# Altium project 16_Channel.PrjPCB
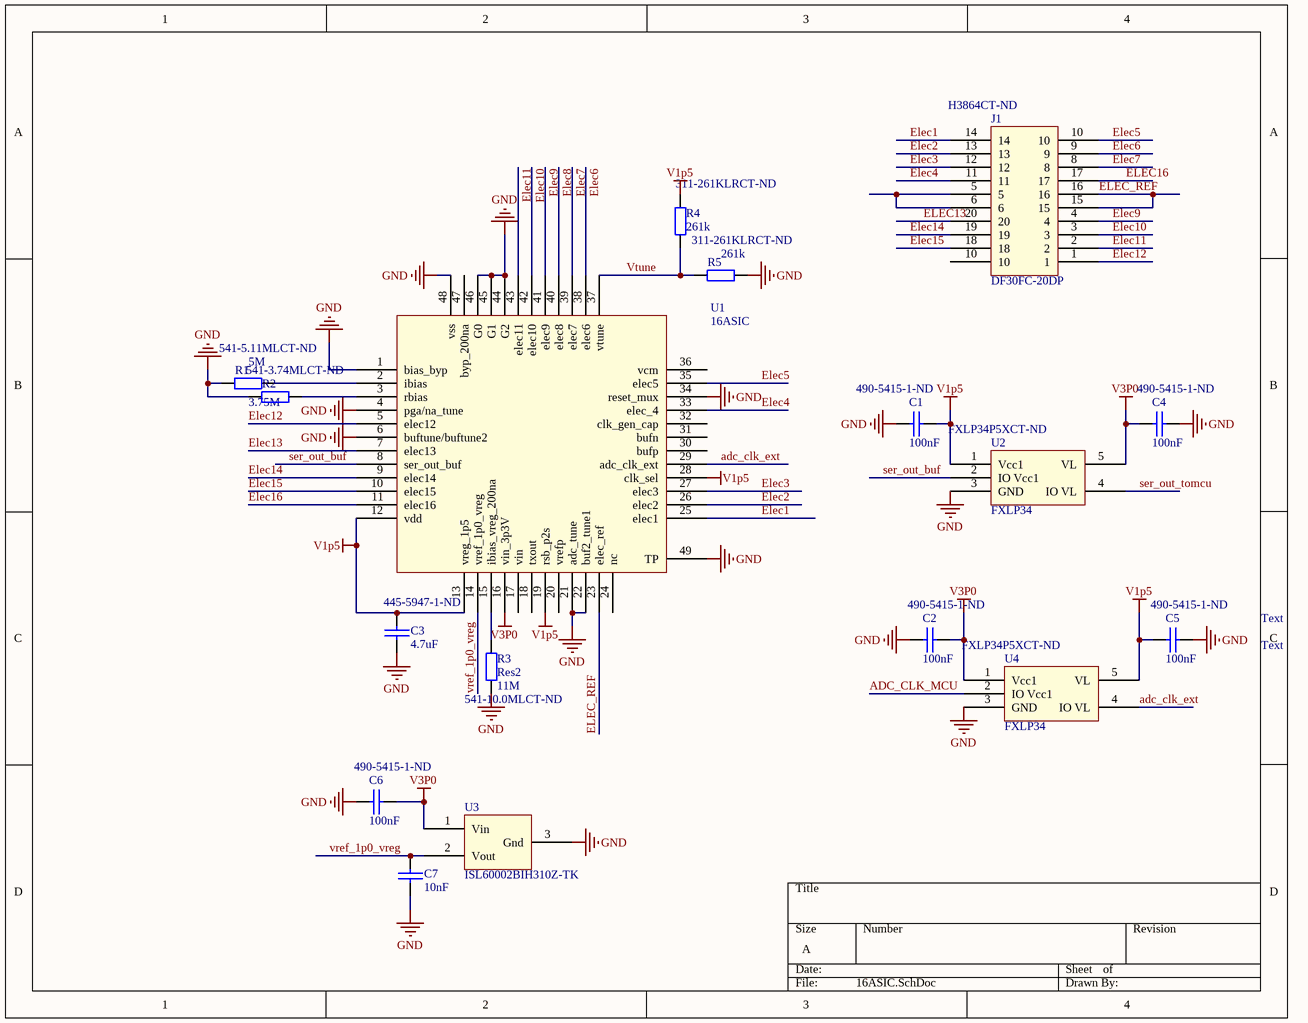
[diagram p0: 16ASIC.SchDoc]
2 sheets, 36 parts. Net scope: global (net labels, ports and power ports of the same name join across sheets).
Board file: 16 chan.PcbDoc
Sheets:
  16ASIC.SchDoc
  Main.SchDoc

## Sheet 16ASIC.SchDoc
size A

### Parts
C1  value 100nF  Supplier Part Number 1: 490-5415-1-ND  [0402s]  (hidden comment: NP0 50V)
C2  value 100nF  Supplier Part Number 1: 490-5415-1-ND  [0402s]  (hidden comment: NP0 50V)
C3  value 4.7uF  Supplier Part Number 1: 445-5947-1-ND  [0402s]  (hidden comment: NP0 50V)
C4  value 100nF  Supplier Part Number 1: 490-5415-1-ND  [0402s]  (hidden comment: NP0 50V)
C5  value 100nF  Supplier Part Number 1: 490-5415-1-ND  [0402s]  (hidden comment: NP0 50V)
C6  value 100nF  Supplier Part Number 1: 490-5415-1-ND  [0402s]  (hidden comment: NP0 50V)
C7  value 10nF  [0402s]  (hidden comment: NP0 50V)
J1  DF30FC-20DP  Supplier Part Number 1: H3864CT-ND  [DF30FC-20DP]
R1  value 5M  Supplier Part Number 1: 541-5.11MLCT-ND  [0402s]  (hidden comment: Res2)
R2  value 3.75M  Supplier Part Number 1: 541-3.74MLCT-ND  [0402s]  (hidden comment: Res2)
R3  Res2  value 11M  Supplier Part Number 1: 541-10.0MLCT-ND  [0402s]
R4  value 261k  Supplier Part Number 1: 311-261KLRCT-ND  [0402s]  (hidden comment: Res2)
R5  value 261k  Supplier Part Number 1: 311-261KLRCT-ND  [0402s]  (hidden comment: Res2)
U1  16ASIC
U2  FXLP34  Supplier Part Number 1: FXLP34P5XCT-ND  [SOT353-5AN]
U3  ISL60002BIH310Z-TK  [SOT23-3L]
U4  FXLP34  Supplier Part Number 1: FXLP34P5XCT-ND  [SOT353-5AN]

### Nets
GND: C1.1 C2.1 C3.2 C4.2 C5.2 C6.1 C7.1 R1.1 R2.1 R3.1 R5.2 U1.1(bias_byp) U1.4(pga/na_tune) U1.6(buftune/buftune2) U1.21(adc_tune) U1.22(buf2_tune1) U1.34(reset_mux) U1.44(G2) U1.45(G1) U1.46(G0) U1.48(vss) U1.49(TP) U2.3(GND) U3.3(Gnd) U4.3(GND)
V1p5: C1.2 C3.1 C5.1 R4.2 U1.12(vdd) U1.13(vreg_1p5) U1.19(rsb_p2s) U1.28(clk_sel) U2.1(Vcc1) U4.5(VL)
V3P0: C2.2 C4.1 C6.2 U1.16(vin_3p3V) U2.5(VL) U3.1(Vin) U4.1(Vcc1)
adc_clk_ext: U1.29(adc_clk_ext) U4.4(IO_VL)
ADC_CLK_MCU: U4.2(IO_Vcc1)
Elec1: J1.14 U1.25(elec1)
Elec2: J1.13 U1.26(elec2)
Elec3: J1.12 U1.27(elec3)
Elec4: J1.11 U1.33(elec_4)
Elec5: J1.10 U1.35(elec5)
Elec6: J1.9 U1.38(elec6)
Elec7: J1.8 U1.39(elec7)
Elec8: U1.40(elec8)
Elec9: J1.4 U1.41(elec9)
Elec10: J1.3 U1.42(elec10)
Elec11: J1.2 U1.43(elec11)
Elec12: J1.1 U1.5(elec12)
Elec13: J1.20 U1.7(elec13)
Elec14: J1.19 U1.9(elec14)
Elec15: J1.18 U1.10(elec15)
Elec16: J1.17 U1.11(elec16)
ELEC_REF: J1.15 J1.16 U1.23(elec_ref)
ser_out_buf: U1.8(ser_out_buf) U2.2(IO_Vcc1)
ser_out_tomcu: U2.4(IO_VL)  [project net FMOSI]
vref_1p0_vreg: C7.2 U1.14(vref_1p0_vreg) U3.2(Vout)
Vtune: R4.1 R5.1 U1.37(vtune)
NetJ1_5: J1.5 J1.6
NetR1_2: R1.2 U1.2(ibias)
NetR2_2: R2.2 U1.3(rbias)
NetR3_2: R3.2 U1.15(ibias_vreg_200na)

Not connected (* = marked no-connect by the designer): U1 17(vin) 18(txout) 20(vrefp) 24(nc) 30(bufp) 31(bufn) 32(clk_gen_cap) 36(vcm) 47(byp_200na)

### Notes on the sheet
- Text

### Library data of the parts
C1 C2 C4-C6 = Cap: Capacitor; Part Field 1: 0402; Manufacturer: Murata Electronics North America; Manufacturer Part Number: GRM155R61C104KA88D; Description: CAP CER .1UF 16V X5R 0402; Capacitance: 0.1µF; Voltage - Rated: 16V; Tolerance: ±10%; Temperature Coefficient: X5R; Supplier 1: Digi-Key; RoHS: RoHS Compliant; Category: Capacitors; Stock 1: 1934090; Pricing 1: 1=0.06, 10=0.038, 50=0.0182, 100=0.0136, 250=0.0098, 500=0.00724, 1000=0.00491 (USD); Mounting Type: Surface Mount, MLCC; Operating Temperature: -55°C ~ 85°C; Applications: General Purpose; Ratings: -; Package / Case: 0402 (1005 Metric); Size / Dimension: 0.039" L x 0.020" W (1.00mm x 0.50mm); Height: -; Thickness: 0.022" (0.55mm); Lead Spacing: -; Features: -; Packaging: Cut Tape (CT); Lead Style: -; ComponentLink1URL: http://search.murata.co.jp/Ceramy/image/img/PDF/ENG/GRM155R61C104KA88.pdf; ComponentLink1Description: http://search.murata.co.jp/Ceramy/image/img/PDF/ENG/GRM155R61C104KA88.pdf
C3 = Cap: Capacitor; Part Field 1: 0402; Manufacturer: TDK Corporation; Manufacturer Part Number: C1005X5R0J475K; Description: CAP CER 4.7UF 6.3V X5R 10% 0402; Capacitance: 4.7µF; Voltage - Rated: 6.3V; Tolerance: ±10%; Temperature Coefficient: X5R; Supplier 1: Digi-Key; RoHS: RoHS Compliant; Category: Capacitors; Stock 1: 168120; Pricing 1: 1=0.53, 10=0.415, 100=0.25, 250=0.18752, 500=0.16, 1000=0.125 (USD); Mounting Type: Surface Mount, MLCC; Operating Temperature: -55°C ~ 85°C; Applications: General Purpose; Ratings: -; Package / Case: 0402 (1005 Metric); Size / Dimension: 0.039" L x 0.020" W (1.00mm x 0.50mm); Height: -; Thickness: 0.022" (0.55mm); Lead Spacing: -; Features: -; Packaging: Cut Tape (CT); Lead Style: -; ComponentLink1URL: http://www.tdk.co.jp/tefe02/e412_c.pdf; ComponentLink1Description: http://www.tdk.co.jp/tefe02/e412_c.pdf
C7 = Cap: Capacitor; Part Field 1: 0402
J1 = DF30FC-20DP: Manufacturer: Hirose Electric Co Ltd; Manufacturer Part Number: DF30FC-20DP-0.4V(82); Description: CONN PLUG 20POS 0.4MM SMD GOLD; Connector Type: Header, Center Strip Contacts; Number of Positions: 20; Pitch: 0.016" (0.40mm); Mated Stacking Heights: 0.9mm; Supplier 1: Digi-Key; RoHS: RoHS Compliant; Category: Connectors, Interconnects; Stock 1: 11216; Pricing 1: 1=1.75, 10=1.426, 25=1.2652, 100=1.035, 250=0.874 (USD); Number of Rows: 2; Mounting Type: Surface Mount; Features: -; Contact Finish: Gold; Contact Finish Thickness: -; Packaging: Cut Tape (CT); Height Above Board: 0.031" (0.80mm); ComponentLink1URL: http://www.hirose.co.jp/cataloge_hp/e68410340.pdf; ComponentLink1Description: http://www.hirose.co.jp/cataloge_hp/e68410340.pdf
R1 = Res2: Resistor; Manufacturer: Vishay/Dale; Manufacturer Part Number: CRCW04025M11FKED; Description: RES 5.11M OHM 1/16W 1% 0402 SMD; Resistance (Ohms): 5.11M; Power (Watts): 0.063W, 1/16W; Temperature Coefficient: ±100ppm/°C; Tolerance: ±1%; Published: 8-Jun-2000; LatestRevisionDate: 17-Jul-2002; LatestRevisionNote: Re-released for DXP Platform.; PackageReference: AXIAL-0.4; Publisher: Altium Limited; PackageDescription: Axial Device, Thru-Hole; 2 Leads; 0.4 in Pin Spacing; Supplier 1: Digi-Key; RoHS: RoHS Compliant; Category: Resistors; Stock 1: 98650; Pricing 1: 10=0.083, 50=0.0444, 200=0.0255, 1000=0.0174 (USD); Composition: Thick Film; Features: -; Size / Dimension: 0.039" L x 0.020" W (1.00mm x 0.50mm); Height: 0.014" (0.35mm); Number of Terminations: 2; Packaging: Cut Tape (CT); Package / Case: 0402 (1005 Metric); ComponentLink1URL: http://www.vishay.com/doc?20035; ComponentLink1Description: http://www.vishay.com/doc?20035
R2 = Res2: Resistor; Manufacturer: Vishay/Dale; Manufacturer Part Number: CRCW04023M74FKED; Description: RES 3.74M OHM 1/16W 1% 0402 SMD; Resistance (Ohms): 3.74M; Power (Watts): 0.063W, 1/16W; Temperature Coefficient: ±100ppm/°C; Tolerance: ±1%; Published: 8-Jun-2000; LatestRevisionDate: 17-Jul-2002; LatestRevisionNote: Re-released for DXP Platform.; PackageReference: AXIAL-0.4; Publisher: Altium Limited; PackageDescription: Axial Device, Thru-Hole; 2 Leads; 0.4 in Pin Spacing; Supplier 1: Digi-Key; RoHS: RoHS Compliant; Category: Resistors; Stock 1: 25816; Pricing 1: 10=0.083, 50=0.0444, 200=0.0255, 1000=0.0174 (USD); Composition: Thick Film; Features: -; Size / Dimension: 0.039" L x 0.020" W (1.00mm x 0.50mm); Height: 0.014" (0.35mm); Number of Terminations: 2; Packaging: Cut Tape (CT); Package / Case: 0402 (1005 Metric); ComponentLink1URL: http://www.vishay.com/doc?20035; ComponentLink1Description: http://www.vishay.com/doc?20035
R3 = Res2: Resistor; Manufacturer: Vishay/Dale; Manufacturer Part Number: CRCW040210M0FKED; Description: RES 10.0M OHM 1/16W 1% 0402 SMD; Resistance (Ohms): 10M; Power (Watts): 0.063W, 1/16W; Temperature Coefficient: ±100ppm/°C; Tolerance: ±1%; Published: 8-Jun-2000; LatestRevisionDate: 17-Jul-2002; LatestRevisionNote: Re-released for DXP Platform.; PackageReference: AXIAL-0.4; Publisher: Altium Limited; PackageDescription: Axial Device, Thru-Hole; 2 Leads; 0.4 in Pin Spacing; Supplier 1: Digi-Key; RoHS: RoHS Compliant; Category: Resistors; Stock 1: 220964; Pricing 1: 10=0.083, 50=0.0444, 200=0.0255, 1000=0.0174 (USD); Composition: Thick Film; Features: -; Size / Dimension: 0.039" L x 0.020" W (1.00mm x 0.50mm); Height: 0.014" (0.35mm); Number of Terminations: 2; Packaging: Cut Tape (CT); Package / Case: 0402 (1005 Metric); ComponentLink1URL: http://www.vishay.com/doc?20035; ComponentLink1Description: http://www.vishay.com/doc?20035
R4 R5 = Res2: Resistor; Manufacturer: Yageo; Manufacturer Part Number: RC0402FR-07261KL; Description: RES 261K OHM 1/16W 1% 0402 SMD; Power (Watts): 0.063W, 1/16W; Temperature Coefficient: ±100ppm/°C; Tolerance: ±1%; Published: 8-Jun-2000; LatestRevisionDate: 17-Jul-2002; LatestRevisionNote: Re-released for DXP Platform.; PackageReference: AXIAL-0.4; Publisher: Altium Limited; PackageDescription: Axial Device, Thru-Hole; 2 Leads; 0.4 in Pin Spacing; Supplier 1: Digi-Key; RoHS: RoHS Compliant; Category: Resistors; Stock 1: 26620; Pricing 1: 10=0.014, 50=0.0104, 100=0.0079, 250=0.00584, 500=0.00432, 1000=0.00288 (USD); Resistance (Ohms): 261K; Composition: Thick Film; Features: -; Size / Dimension: 0.039" L x 0.020" W (1.00mm x 0.50mm); Height: 0.014" (0.35mm); Number of Terminations: 2; Packaging: Cut Tape (CT); Package / Case: 0402 (1005 Metric); ComponentLink1URL: http://www.yageo.com/documents/recent/PYu-RC0402_51_RoHS_L_6.pdf; ComponentLink1Description: http://www.yageo.com/documents/recent/PYu-RC0402_51_RoHS_L_6.pdf
U2 U4 = FXLP34: Manufacturer: Fairchild Semiconductor; Manufacturer Part Number: FXLP34P5X; Description: TRANSLATOR 1BIT UNIDIRECT SC70-5; Logic Function: Translator, Unidirectional; Number of Bits: 1; Input Type: Voltage; Differential - Input:Output: No/No; Propagation Delay (Max): 3ns; Voltage - Supply: 1 V ~ 3.6 V; Supplier 1: Digi-Key; RoHS: RoHS Compliant; Category: Integrated Circuits (ICs); Stock 1: 73920; Pricing 1: 1=0.77, 25=0.5916, 100=0.522, 250=0.4524, 500=0.3828, 750=0.3306, 1000=0.3045, 2000=0.2784 (USD); Output Type: Voltage; Data Rate: -; Number of Channels: 1; Number of Outputs/Channel: 1; Operating Temperature: -40°C ~ 85°C; Package / Case: 6-TSSOP (5 lead), SC-88A, SOT-353; Supplier Device Package: SC-70-5; Packaging: Cut Tape (CT); ComponentLink1URL: http://www.fairchildsemi.com/ds/FX/FXLP34.pdf; ComponentLink1Description: http://www.fairchildsemi.com/ds/FX/FXLP34.pdf
U3 = ISL60002BIH310Z-TK: IC VOLT REF FGA LV 1.024V SOT-23; Manufacturer: Intersil; Reference Type: Series, Precision; Tolerance: ±1mV; Temperature Coefficient: 20ppm/°C; Voltage - Input: 2.7 V ~ 5.5 V; Number of Channels: 1; Current - Quiescent: 900nA; Current - Output: 7mA; Supplier 1: Digi-Key; Manufacturer Part Number: ISL60002BIH310Z-TK; RoHS: RoHS Compliant; Category: Integrated Circuits (ICs); Stock 1: 3269; Pricing 1: 1=5.99, 25=4.86, 100=4.13 (USD); Voltage - Output: 1.024V; Current - Cathode: -; Operating Temperature: -40°C ~ 85°C; Mounting Type: Surface Mount; Package / Case: TO-236-3, SC-59, SOT-23-3; Supplier Device Package: SOT-23-3; Packaging: Cut Tape (CT); ComponentLink1URL: http://www.intersil.com/data/fn/fn8082.pdf; ComponentLink1Description: http://www.intersil.com/data/fn/fn8082.pdf

## Sheet Main.SchDoc
size A
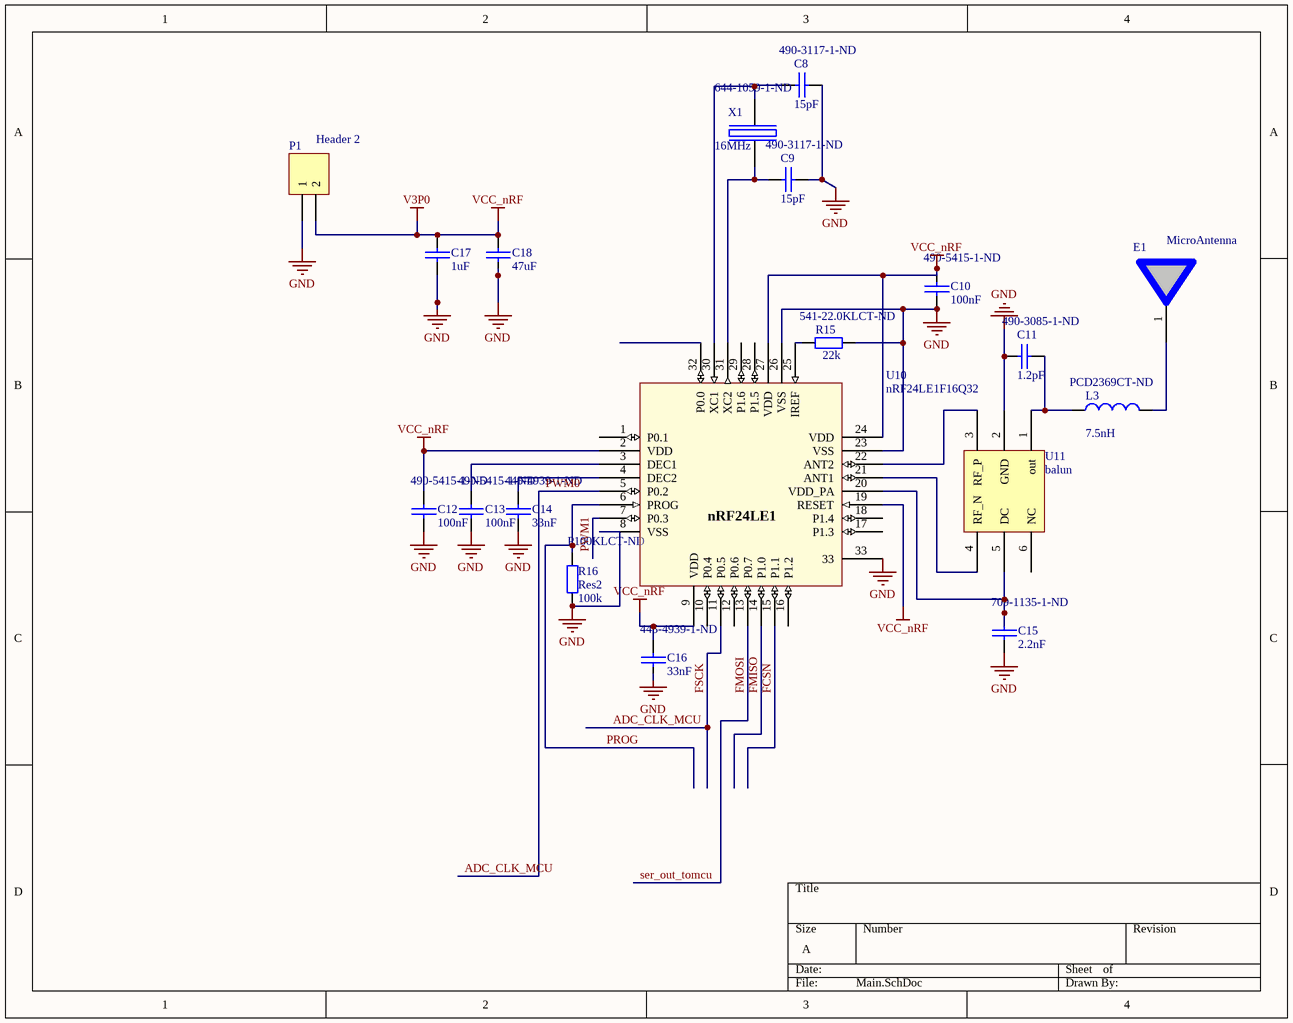
[diagram p1: Main.SchDoc]

### Parts
C8  value 15pF  Supplier Part Number 1: 490-3117-1-ND  [0402s]  (hidden comment: NP0 50V)
C9  value 15pF  Supplier Part Number 1: 490-3117-1-ND  [0402s]  (hidden comment: NP0 50V)
C10  value 100nF  Supplier Part Number 1: 490-5415-1-ND  [0402s]  (hidden comment: NP0 50V)
C11  value 1.2pF  Supplier Part Number 1: 490-3085-1-ND  [0402s]  (hidden comment: NP0 50V)
C12  value 100nF  Supplier Part Number 1: 490-5415-1-ND  [0402s]  (hidden comment: NP0 50V)
C13  value 100nF  Supplier Part Number 1: 490-5415-1-ND  [0402s]  (hidden comment: NP0 50V)
C14  value 33nF  Supplier Part Number 1: 445-4939-1-ND  [0402s]  (hidden comment: NP0 50V)
C15  value 2.2nF  Supplier Part Number 1: 709-1135-1-ND  [0402s]  (hidden comment: NP0 50V)
C16  value 33nF  Supplier Part Number 1: 445-4939-1-ND  [0402s]  (hidden comment: NP0 50V)
C17  value 1uF  [0402s]  (hidden comment: NP0 50V)
C18  value 47uF  [J1-0603]  (hidden comment: NP0 50V)
E1  MicroAntenna  [microantenna]
L3  value 7.5nH  Supplier Part Number 1: PCD2369CT-ND  [0402-A]  (hidden comment: Inductor)
P1  Header 2  [HDR1X2]
R15  value 22k  Supplier Part Number 1: 541-22.0KLCT-ND  [0402s]  (hidden comment: Res2)
R16  Res2  value 100k  Supplier Part Number 1: P100KLCT-ND  [0402s]
U10  value nRF24LE1F16Q32  [Nordic_QFN50P500X500X90-33N]  (hidden comment: QFN32 5x5 package)
U11  balun  [balun]
X1  value 16MHz  Supplier Part Number 1: 644-1059-1-ND  [bt-xtal 2.5 x 2 mm]  (hidden comment: TSX-3225, 16MHz, Cl=9pF, +/-10ppm)

### Nets
GND: C8.1 C9.2 C10.2 C11.1 C12.2 C13.1 C14.2 C15.2 C16.1 C17.2 C18.2 P1.1 R15.2 R16.1 U10.8(VSS) U10.23(VSS) U10.26(VSS) U10.33 U11.2(GND) X1.2(GND) X1.4(GND)
V3P0: C10.1 C12.1 C16.2 C17.1 C18.1 P1.2 U10.2(VDD) U10.9(VDD) U10.19(RESET) U10.24(VDD) U10.27(VDD)  [also labelled VCC_nRF]
ADC_CLK_MCU: U10.5(P0.2) U10.11(P0.5)  [also labelled FSCK, PWM0]
FCSN: U10.15(P1.1)
FMISO: U10.14(P1.0)
FMOSI: U10.13(P0.7)  [also labelled ser_out_tomcu]
PROG: R16.2 U10.6(PROG)
PWM1: U10.7(P0.3)
NetC8_2: C8.2 U10.30(XC1) X1.3(out)
NetC9_1: C9.1 U10.31(XC2) X1.1(inp)
NetC11_2: C11.2 L3.1 U11.1(out)
NetC13_2: C13.2 U10.3(DEC1)
NetC14_1: C14.1 U10.4(DEC2)
NetC15_1: C15.1 U10.20(VDD_PA) U11.5(DC)
NetE1_1: E1.1 L3.2
NetR15_1: R15.1 U10.25(IREF)
NetU10_21: U10.21(ANT1) U11.4(RF_N)
NetU10_22: U10.22(ANT2) U11.3(RF_P)

Not connected (* = marked no-connect by the designer): E1 2; U10 1(P0.1) 10(P0.4) 12(P0.6) 16(P1.2) 17(P1.3) 18(P1.4) 28(P1.5) 29(P1.6) 32(P0.0); U11 6(NC)

### Notes on the sheet
- (in symbol nRF24LE1 - 5x5) nRF24LE1

### Library data of the parts
C8 C9 = Cap: Capacitor; Part Field 1: 0402; Manufacturer: Murata Electronics North America; Manufacturer Part Number: GJM1555C1H150JB01D; Description: CAP CERAMIC 15PF 50V C0G 0402; Tolerance: ±5%; Temperature Coefficient: C0G, NP0; Supplier 1: Digi-Key; RoHS: RoHS Compliant; Category: Capacitors; Stock 1: 646130; Pricing 1: 1=0.23, 10=0.143, 50=0.0686, 100=0.0515, 250=0.0372, 500=0.02746, 1000=0.01859 (USD); Capacitance: 15pF; Voltage - Rated: 50V; Mounting Type: Surface Mount, MLCC; Operating Temperature: -55°C ~ 125°C; Applications: RF, Microwave, High Frequency; Ratings: -; Package / Case: 0402 (1005 Metric); Size / Dimension: 0.039" L x 0.020" W (1.00mm x 0.50mm); Height: -; Thickness: 0.022" (0.55mm); Lead Spacing: -; Features: High Q, Low Loss; Packaging: Cut Tape (CT); Lead Style: -; ComponentLink1URL: http://search.murata.co.jp/Ceramy/image/img/PDF/ENG/GJM1555C1H150JB01.pdf; ComponentLink1Description: http://search.murata.co.jp/Ceramy/image/img/PDF/ENG/GJM1555C1H150JB01.pdf
C10 C12 C13 = Cap: as C1 on sheet 16ASIC; Supplier 1: Digi-Key; RoHS: RoHS Compliant; Category: Capacitors; Stock 1: 1934090; Pricing 1: 1=0.06, 10=0.038, 50=0.0182, 100=0.0136, 250=0.0098, 500=0.00724, 1000=0.00491 (USD); Mounting Type: Surface Mount, MLCC; Operating Temperature: -55°C ~ 85°C; Applications: General Purpose; Ratings: -; Package / Case: 0402 (1005 Metric); Size / Dimension: 0.039" L x 0.020" W (1.00mm x 0.50mm); Height: -; Thickness: 0.022" (0.55mm); Lead Spacing: -; Features: -; Packaging: Cut Tape (CT); Lead Style: -; ComponentLink1URL: http://search.murata.co.jp/Ceramy/image/img/PDF/ENG/GRM155R61C104KA88.pdf; ComponentLink1Description: http://search.murata.co.jp/Ceramy/image/img/PDF/ENG/GRM155R61C104KA88.pdf
C11 = Cap: Capacitor; Part Field 1: 0402; Manufacturer: Murata Electronics North America; Manufacturer Part Number: GJM1555C1H1R2CB01D; Description: CAP CERAMIC 1.2PF 50V C0G 0402; Tolerance: ±0.25pF; Temperature Coefficient: C0G, NP0; Supplier 1: Digi-Key; RoHS: RoHS Compliant; Category: Capacitors; Stock 1: 74798; Pricing 1: 1=0.23, 10=0.143, 50=0.0686, 100=0.0515, 250=0.0372, 500=0.02746, 1000=0.01859 (USD); Capacitance: 1.2pF; Voltage - Rated: 50V; Mounting Type: Surface Mount, MLCC; Operating Temperature: -55°C ~ 125°C; Applications: RF, Microwave, High Frequency; Ratings: -; Package / Case: 0402 (1005 Metric); Size / Dimension: 0.039" L x 0.020" W (1.00mm x 0.50mm); Height: -; Thickness: 0.022" (0.55mm); Lead Spacing: -; Features: High Q, Low Loss; Packaging: Cut Tape (CT); Lead Style: -; ComponentLink1URL: http://search.murata.co.jp/Ceramy/image/img/PDF/ENG/GJM1555C1H1R2CB01.pdf; ComponentLink1Description: http://search.murata.co.jp/Ceramy/image/img/PDF/ENG/GJM1555C1H1R2CB01.pdf
C14 C16 = Cap: Capacitor; Part Field 1: 0402; Manufacturer: TDK Corporation; Manufacturer Part Number: C1005X7R1E333K; Description: CAP CER 33000PF 25V X7R 0402; Capacitance: 0.033µF; Voltage - Rated: 25V; Tolerance: ±10%; Temperature Coefficient: X7R; Supplier 1: Digi-Key; RoHS: RoHS Compliant; Category: Capacitors; Stock 1: 173005; Pricing 1: 1=0.13, 10=0.083, 100=0.0297, 250=0.02144, 500=0.01584, 1000=0.01073 (USD); Mounting Type: Surface Mount, MLCC; Operating Temperature: -55°C ~ 125°C; Applications: General Purpose; Ratings: -; Package / Case: 0402 (1005 Metric); Size / Dimension: 0.039" L x 0.020" W (1.00mm x 0.50mm); Height: -; Thickness: 0.022" (0.55mm); Lead Spacing: -; Features: -; Packaging: Cut Tape (CT); Lead Style: -; ComponentLink1URL: http://www.tdk.co.jp/tefe02/e412_c.pdf; ComponentLink1Description: http://www.tdk.co.jp/tefe02/e412_c.pdf
C15 = Cap: Capacitor; Part Field 1: 0402; Manufacturer: Johanson Dielectrics Inc; Manufacturer Part Number: 500R07W222KV4T; Description: CAP CER 2200PF 50V X7R 0402; Capacitance: 2200pF; Tolerance: ±10%; Temperature Coefficient: X7R; Supplier 1: Digi-Key; RoHS: RoHS Compliant; Category: Capacitors; Stock 1: 32969; Pricing 1: 10=0.029, 100=0.0169, 500=0.00976, 1000=0.00676 (USD); Voltage - Rated: 50V; Mounting Type: Surface Mount, MLCC; Operating Temperature: -55°C ~ 125°C; Applications: General Purpose; Ratings: -; Package / Case: 0402 (1005 Metric); Size / Dimension: 0.040" L x 0.020" W (1.02mm x 0.51mm); Height: -; Thickness: 0.025" (0.64mm); Lead Spacing: -; Features: -; Packaging: Cut Tape (CT); Lead Style: -; ComponentLink1URL: http://www.johansondielectrics.com/images/stories/surface-mount/smt-mlc/JDI_Surface-Mount_2008-11.pdf; ComponentLink1Description: http://www.johansondielectrics.com/images/stories/surface-mount/smt-mlc/JDI_Surface-Mount_2008-11.pdf
C17 C18 = Cap: Capacitor; Part Field 1: 0402
L3 = Inductor: Manufacturer: Panasonic - ECG; Manufacturer Part Number: ELJ-RF7N5ZFB; Code_IEC: 1005; Description: INDUCTOR 7.5NH +/-.2NH 0402 SMD; Current: 320mA; Type: Non-Magnetic Core; Tolerance: ±0.2nH; DC Resistance (DCR): 330 mOhm Max; Q @ Freq: 8 @ 100MHz; Self Resonant Freq: 3.7GHz; Frequency - Test: 100MHz; Published: 8-Jun-2000; LatestRevisionDate: 29-May-2009; LatestRevisionNote: IPC-7351 Footprint Added.; PackageReference: 0402-A; Publisher: Altium Limited; PackageDescription: Chip Inductor; Code_JEITA: 0402; Supplier 1: Digi-Key; RoHS: RoHS Compliant; Category: Inductors, Coils, Chokes; Stock 1: 19566; Pricing 1: 1=0.08, 50=0.0786, 100=0.0593, 500=0.05446, 1000=0.04356 (USD); Inductance: 7.5nH; Current - Saturation: -; Current - Temperature Rise: -; Shielding: -; Package / Case: 0402 (1005 Metric); Mounting Type: Surface Mount; Packaging: Cut Tape (CT); Operating Temperature: -20°C ~ 85°C; Material - Core: -; Applications: High Frequency; ComponentLink1URL: http://industrial.panasonic.com/www-cgi/jvcr13pz.cgi?E+PZ+3+AGA0024+ELJRF7N5ZFB+7+WW; ComponentLink1Description: http://industrial.panasonic.com/www-cgi/jvcr13pz.cgi?E+PZ+3+AGA0024+ELJRF7N5ZFB+7+WW
P1 = Header 2: Header, 2-Pin; LatestRevisionDate: 17-Jul-2002; LatestRevisionNote: Re-released for DXP Platform.; Publisher: Altium Limited
R15 = Res2: Resistor; Manufacturer: Vishay/Dale; Manufacturer Part Number: CRCW040222K0FKED; Description: RES 22.0K OHM 1/16W 1% 0402 SMD; Power (Watts): 0.063W, 1/16W; Temperature Coefficient: ±100ppm/°C; Tolerance: ±1%; Published: 8-Jun-2000; LatestRevisionDate: 17-Jul-2002; LatestRevisionNote: Re-released for DXP Platform.; PackageReference: AXIAL-0.4; Publisher: Altium Limited; PackageDescription: Axial Device, Thru-Hole; 2 Leads; 0.4 in Pin Spacing; Supplier 1: Digi-Key; RoHS: RoHS Compliant; Category: Resistors; Stock 1: 360487; Pricing 1: 10=0.083, 50=0.0444, 200=0.0255, 1000=0.0174 (USD); Resistance (Ohms): 22K; Composition: Thick Film; Features: -; Size / Dimension: 0.039" L x 0.020" W (1.00mm x 0.50mm); Height: 0.014" (0.35mm); Number of Terminations: 2; Packaging: Cut Tape (CT); Package / Case: 0402 (1005 Metric); ComponentLink1URL: http://www.vishay.com/doc?20035; ComponentLink1Description: http://www.vishay.com/doc?20035
R16 = Res2: Resistor; Manufacturer: Panasonic - ECG; Manufacturer Part Number: ERJ-2RKF1003X; Description: RES 100K OHM 1/10W 1% 0402 SMD; Power (Watts): 0.1W, 1/10W; Temperature Coefficient: ±100ppm/°C; Tolerance: ±1%; Published: 8-Jun-2000; LatestRevisionDate: 17-Jul-2002; LatestRevisionNote: Re-released for DXP Platform.; PackageReference: AXIAL-0.4; Publisher: Altium Limited; PackageDescription: Axial Device, Thru-Hole; 2 Leads; 0.4 in Pin Spacing; Supplier 1: Digi-Key; RoHS: RoHS Compliant; Category: Resistors; Stock 1: 6906500; Pricing 1: 1=0.06, 50=0.0242, 100=0.0184, 250=0.01364, 500=0.01008, 1000=0.00672, 5000=0.00473 (USD); Resistance (Ohms): 100K; Composition: Thick Film; Features: -; Size / Dimension: 0.039" L x 0.020" W (1.00mm x 0.50mm); Height: 0.014" (0.35mm); Number of Terminations: 2; Packaging: Cut Tape (CT); Package / Case: 0402 (1005 Metric); ComponentLink1URL: http://industrial.panasonic.com/www-cgi/jvcr13pz.cgi?E+PZ+3+AOA0002+ERJ2RKF1003X+7+WW; ComponentLink1Description: http://industrial.panasonic.com/www-cgi/jvcr13pz.cgi?E+PZ+3+AOA0002+ERJ2RKF1003X+7+WW
U10 = nRF24LE1 - 5x5: 2.4GHz Tranceiver with embedded MCU and 10 bit ADC
X1 = BT-XTAL: Crystal; Manufacturer: NDK; Manufacturer Part Number: NX2520SA-16.000000MHZ; Description: CRYSTAL 16.000000 MHZ 10PF SMD; Frequency Stability: ±10ppm; Load Capacitance: 10pF; Operating Mode: Fundamental; Supplier 1: Digi-Key; RoHS: RoHS Compliant; Category: Crystals and Oscillators; Stock 1: 12577; Pricing 1: 1=2.12, 10=1.839, 50=1.6128, 100=1.2733, 500=1.07524, 750=0.93943, 1000=0.84888 (USD); Type: MHz Crystal; Frequency: 16MHz; Frequency Tolerance: ±10ppm; Operating Temperature: -10°C ~ 60°C; Mounting Type: Surface Mount; Package / Case: 4-SMD, No Lead (DFN, LCC); Size / Dimension: 0.098" L x 0.079" W (2.50mm x 2.00mm); Height: 0.026" (0.65mm); Packaging: Cut Tape (CT); ComponentLink1URL: http://media.digikey.com/pdf/Data%20Sheets/NDK%20PDFs/NX2520SA.pdf; ComponentLink1Description: http://media.digikey.com/pdf/Data%20Sheets/NDK%20PDFs/NX2520SA.pdf

## Nets that join several sheets
GND: 16ASIC (25 pins), Main (21 pins)
V3P0: 16ASIC (7 pins), Main (11 pins)
ADC_CLK_MCU: 16ASIC (U4.2), Main (U10.5 U10.11)
FMOSI: 16ASIC (U2.4), Main (U10.13)